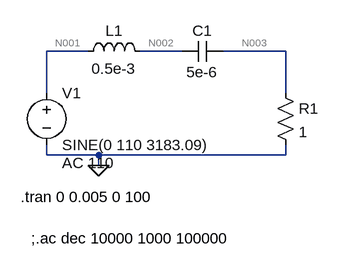
[diagram p0: schematic Draft2.asc]
Draft2.asc, the LTspice schematic file:
Version 4
SHEET 1 880 680
WIRE 96 112 32 112
WIRE 240 112 176 112
WIRE 400 112 304 112
WIRE 32 176 32 112
WIRE 400 176 400 112
WIRE 32 272 32 256
WIRE 112 272 32 272
WIRE 400 272 400 256
WIRE 400 272 112 272
WIRE 112 288 112 272
FLAG 112 288 0
SYMBOL ind 80 128 R270
WINDOW 0 32 56 VTop 2
WINDOW 3 5 56 VBottom 2
SYMATTR InstName L1
SYMATTR Value 0.5e-3
SYMBOL cap 240 128 R270
WINDOW 0 32 32 VTop 2
WINDOW 3 0 32 VBottom 2
SYMATTR InstName C1
SYMATTR Value 5e-6
SYMBOL res 384 160 R0
SYMATTR InstName R1
SYMATTR Value 1
SYMBOL voltage 32 160 R0
WINDOW 123 24 124 Left 2
WINDOW 39 0 0 Left 0
SYMATTR Value2 AC 110
SYMATTR InstName V1
SYMATTR Value SINE(0 110 3183.09)
TEXT -8 336 Left 2 !.tran 0 0.005 0 100
TEXT 8 400 Left 2 !;.ac dec 10000 1000 100000

The netlist it stands for:
* Draft2.asc
L1 N001 N002 0.5e-3
C1 N002 N003 5e-6
R1 N003 0 1
V1 N001 0 SINE(0 110 3183.09) AC 110
.tran 0 0.005 0 100
;.ac dec 10000 1000 100000
.backanno
.end

* Results of the author's LTspice run, read from the files saved beside the schematic
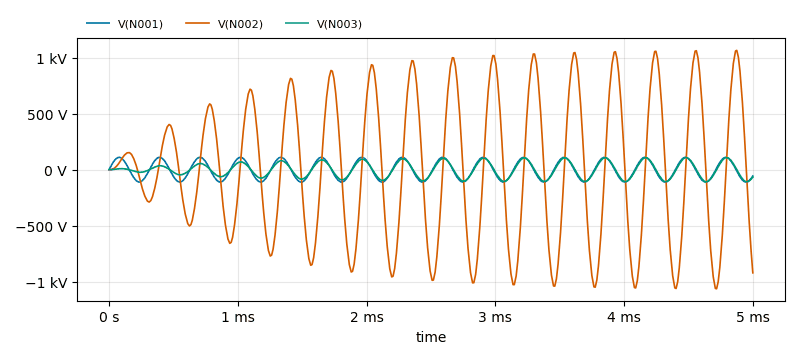
[diagram p1: Transient Analysis of Draft2.asc, plotted from the saved traces]
* Transient Analysis, 1 run:
*   V(N001): min -110 V, max 110 V, average 151.1 mV, rms 78.13 V, last -55.73 V
*   V(N002): min -1.062 kV, max 1.064 kV, average 6.591 V, rms 631 V, last -919.8 V
*   V(N003): min -107.8 V, max 107.7 V, average -850.2 mV, rms 64.1 V, last -66.12 V